# Altium schematic sheet ASBB_MCP25625.SchDoc
size A4
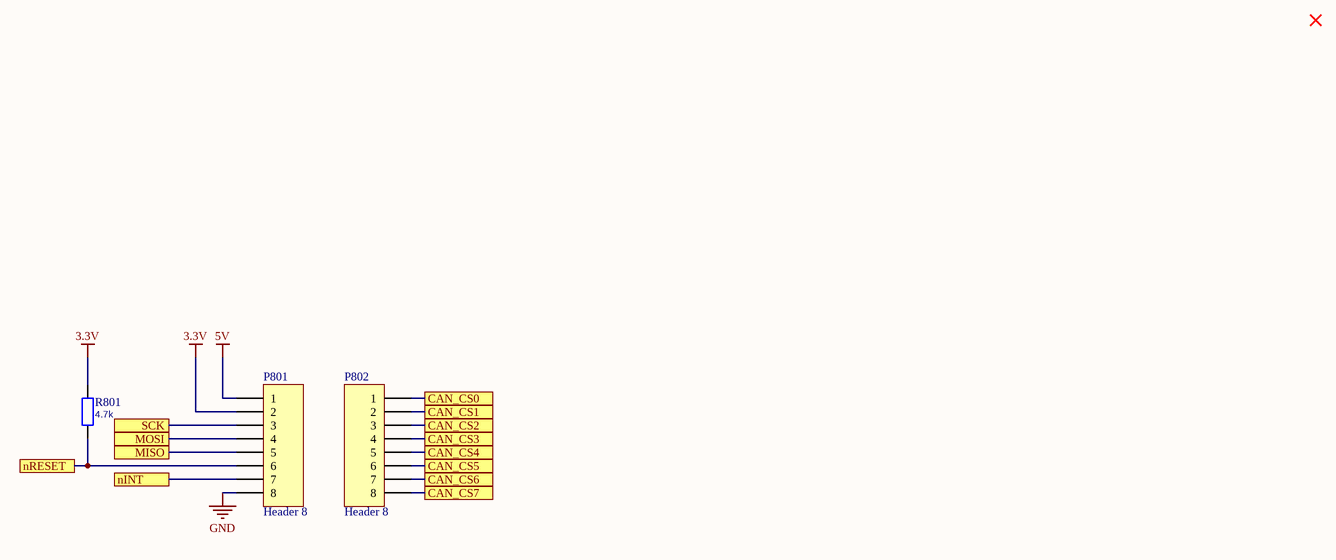
[diagram p0: ASBB_MCP25625.SchDoc]

## Parts
P801  Header 8  [HDR1X8]
P802  Header 8  [HDR1X8]
R801  4.7k  [0603]

## Ports
CAN_CS0, CAN_CS1, CAN_CS2, CAN_CS3, CAN_CS4, CAN_CS5, CAN_CS6, CAN_CS7, MISO, MOSI, nINT, nRESET, SCK

## Nets
3.3V: P801.2 R801.2
5V: P801.1
GND: P801.8
CAN_CS0: P802.1 ; port CAN_CS0
CAN_CS1: P802.2 ; port CAN_CS1
CAN_CS2: P802.3 ; port CAN_CS2
CAN_CS3: P802.4 ; port CAN_CS3
CAN_CS4: P802.5 ; port CAN_CS4
CAN_CS5: P802.6 ; port CAN_CS5
CAN_CS6: P802.7 ; port CAN_CS6
CAN_CS7: P802.8 ; port CAN_CS7
MISO: P801.5 ; port MISO
MOSI: P801.4 ; port MOSI
nINT: P801.7 ; port nINT
nRESET: P801.6 R801.1 ; port nRESET
SCK: P801.3 ; port SCK

## Library data of the parts
P801 P802 = Header 8: Header, 8-Pin; LatestRevisionDate: 17-Jul-2002; LatestRevisionNote: Re-released for DXP Platform.; Publisher: Altium Limited
R801 = Resistor: Partnumber: ?; Value: ?